# EAGLE design untitled (EAGLE 7.2.0)
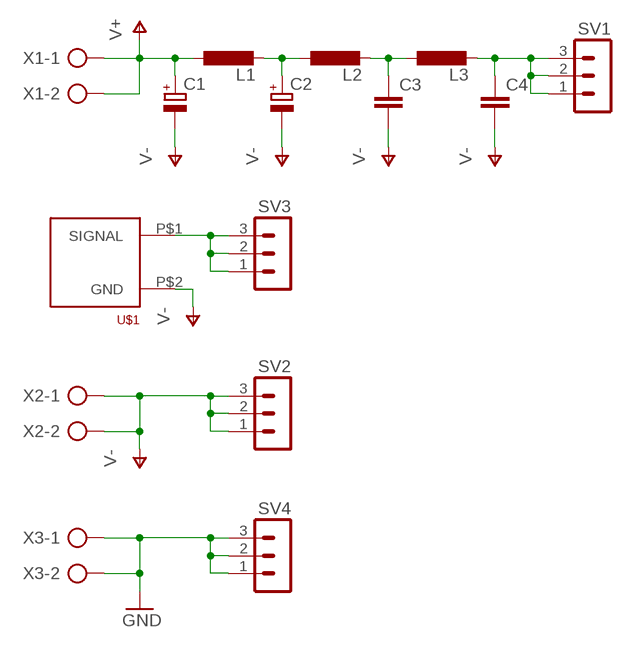
[diagram p0: schematic, sheet 1]

## Parts
C1  CPOL-EUSMCA  [SMC_A]
C2  CPOL-EUSMCA  [SMC_A]
C3  C-EUC1206  [C1206]
C4  C-EUC1206  [C1206]
L1  L-EU0204/7  [0204/7]
L2  L-EUL1812  [L1812]
L3  L-EUL1812  [L1812]
SV1  MA03-1  [MA03-1]
SV2  MA03-1  [MA03-1]
SV3  MA03-1  [MA03-1]
SV4  MA03-1  [MA03-1]
U$1  BNC_VERTICAL  [BNC_VERTICAL]
X1  AK500/2-H  [AK500/2-H]
X2  AK500/2-H  [AK500/2-H]
X3  AK500/2-H  [AK500/2-H]

## Nets
GND: SV4.1 SV4.2 SV4.3 X3.1 X3.2
N$10: C4.1 L3.2 SV1.1 SV1.2 SV1.3
N$11: C2.+ L1.2 L2.1
N$12: SV3.1 SV3.2 SV3.3 U$1.P$1(SIGNAL)
N$13: C3.1 L2.2 L3.1
V+: C1.+ L1.1 X1.1 X1.2
V-: C1.- C2.- C3.2 C4.2 SV2.1 SV2.2 SV2.3 U$1.P$2(GND) X2.1 X2.2

## Library data of the parts
C1 C2 = resistor:CPOL-EU: POLARIZED CAPACITOR, European symbol
C3 C4 = resistor:C-EU: CAPACITOR, European symbol
L1-L3 = resistor:L-EU: INDUCTOR, European symbol
SV1-SV4 = con-lstb:MA03-1: PIN HEADER; OC_FARNELL: unknown; OC_NEWARK: unknown
U$1 = connectors:BNC_VERTICAL: BNC plug, through-hole, vertical
X1-X3 = con-ptr500:AK500/2-H: CONNECTOR Aug. 2004 / PTR Meßtechnik: Die Bezeichnung der Serie AK505 wurde geändert. Es handelt sich hierbei um AK500 in horizontaler Ausführung.; OC_FARNELL: unknown; OC_NEWARK: unknown

## Board
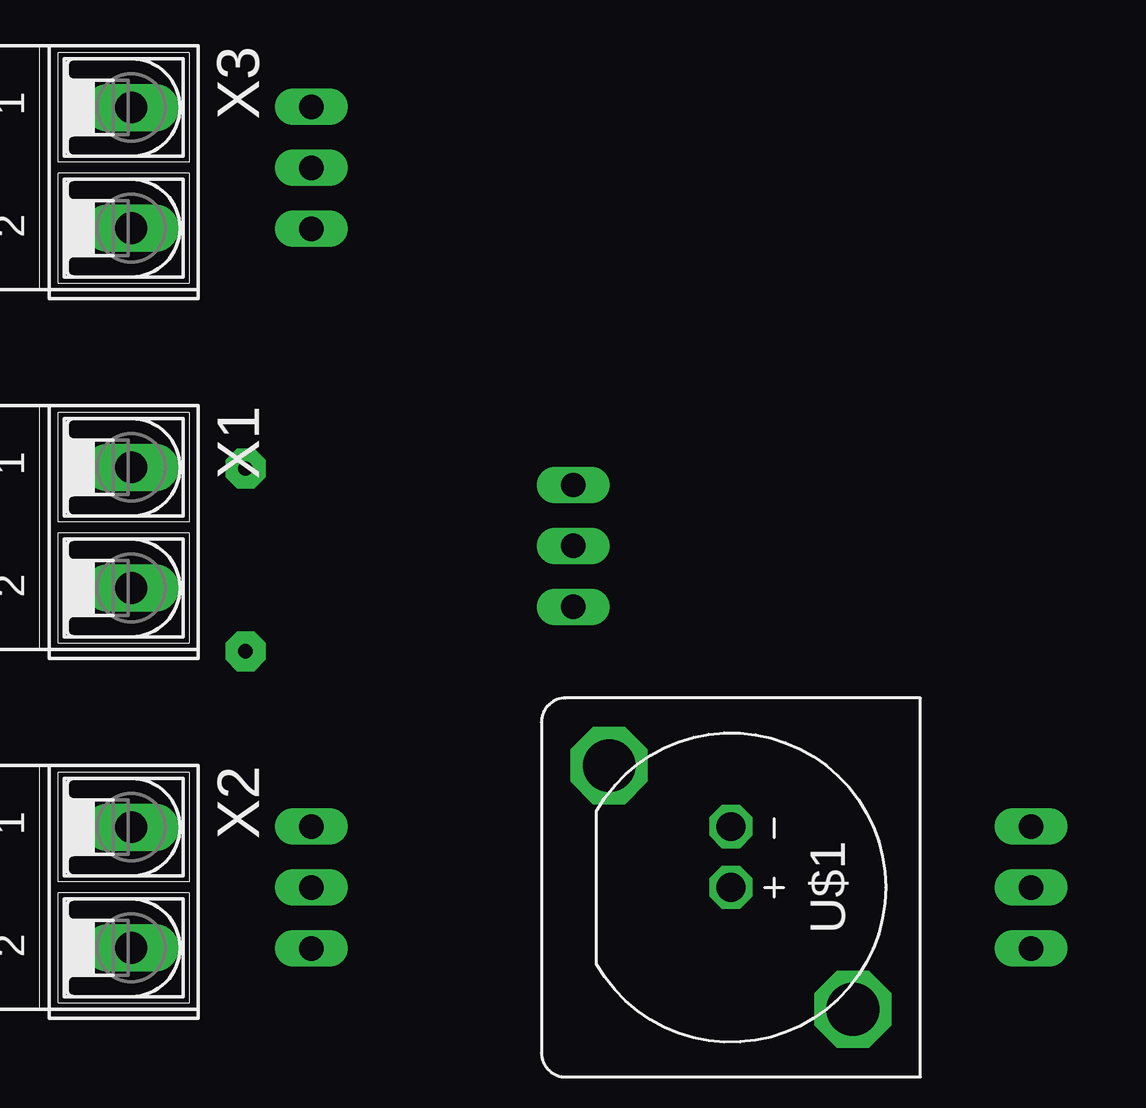
[diagram p1: board, top side]
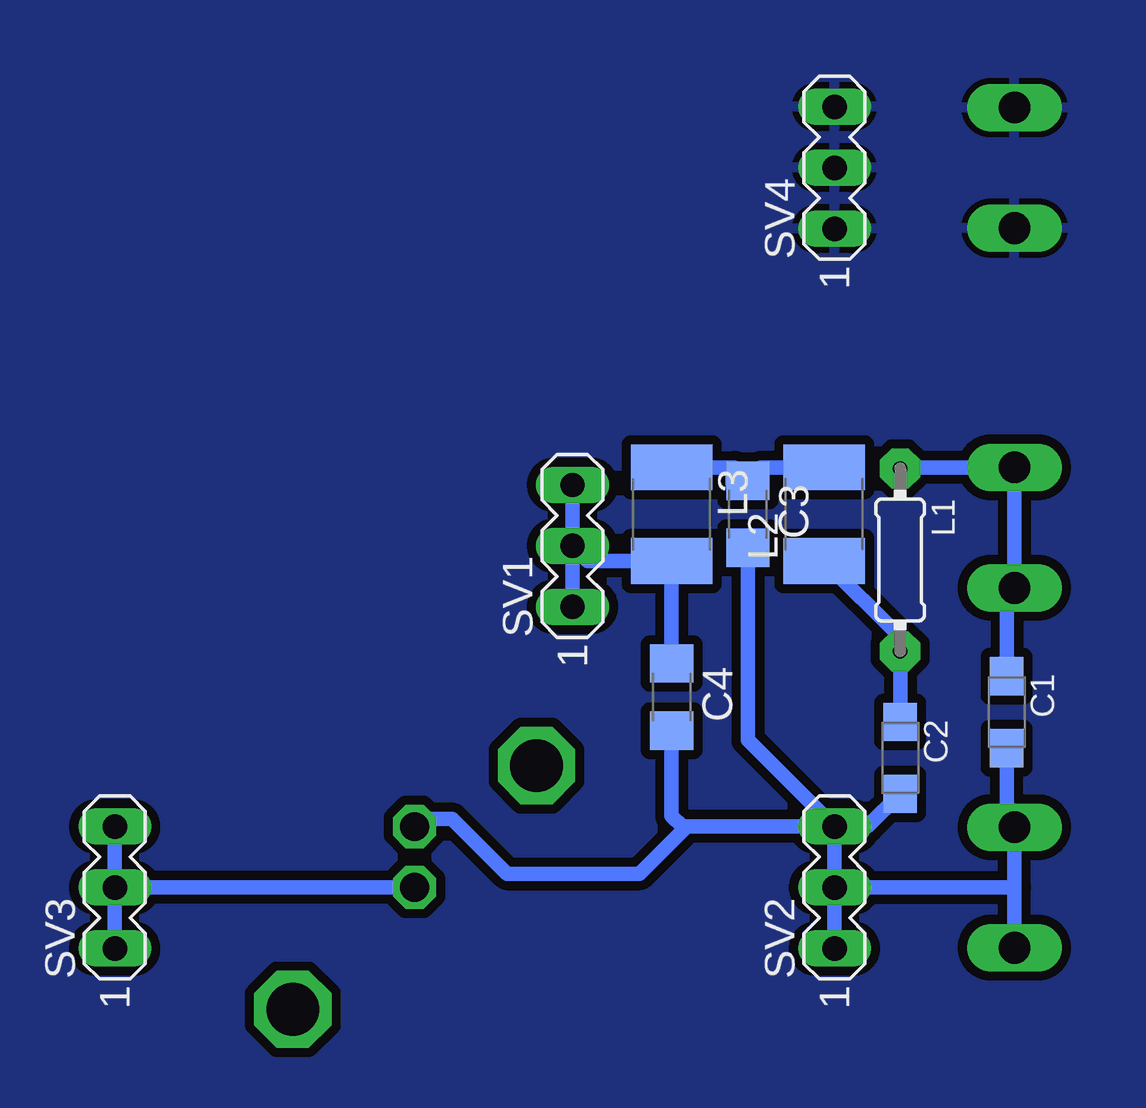
[diagram p2: board, bottom side, seen from below]

No outline drawn. Coordinates in mm, seen from the top.
Copper layers (1*16): Top 0.035mm / dielectric 1.5mm / Bottom 0.035mm
Design rules "default *": minimum track width 10mil, minimum drill 24mil, track to track 15mil, track to pad 15mil, pad to pad 8mil, via to via 8mil, smd to smd 8mil, copper to edge 40mil, drill to drill 8mil, minimum pad ring 10mil, minimum via ring 8mil, stop-mask expansion 4mil, vias tented up to drill 0mil, thermal gap 10mil

### Footprints (pad centres in the part's own frame; a part is rotated, then mirrored left to right if it is on the bottom)
SMC_A = smd 1.6 x 1.4: + -1.5,0; - 1.5,0
C1206 = smd 1.6 x 1.8: 1 -1.4,0; 2 1.4,0
0204/7 = drill 0.6 pad 1.676 octagon: 1 -3.81,0; 2 3.81,0
L1812 = smd 1.9 x 3.4: 1 -1.95,0; 2 1.95,0
MA03-1 = drill 1.016 long: 1 -2.54,0; 2 0,0; 3 2.54,0
BNC_VERTICAL = drill 1.2 octagon: P$1 0,0; P$2 2.54,0 | drill 2.2 octagon: P$3 5.08,5.08; P$4 -5.08,-5.08
AK500/2-H = drill 1.321 long: 1 -2.515,0; 2 2.515,0

### Placement (x,y rotation side)
C1  20.32,27.3 270 bottom
C2  24.77,25.4 270 bottom
C3  31.11,35.56 270 bottom
C4  34.29,27.94 270 bottom
L1  24.77,33.66 270 bottom
L2  27.94,35.56 90 bottom
L3  34.29,35.56 270 bottom
SV1  38.42,34.24 90 bottom
SV2  27.5,20 90 bottom
SV3  57.5,20 90 bottom
SV4  27.5,50 90 bottom
U$1  45,20 90 top
X1  20,35 270 top
X2  20,20 270 top
X3  20,50 270 top

### Tracks (layer width: path | path; a pad name or v marks a point on that pad's centre or on a via)
GND
  pour Bottom (rank 5): 0,0 0,100 100,100 100,0
  pour Bottom (rank 5): 120,0 120,100 220,100 220,0
N$1
  cutout Bottom: 50,120 50,340 150,340 150,120
N$2
  cutout Bottom: 150,120 150,340 250,340 250,120
N$3
  cutout Bottom: -50,120 -50,340 50,340 50,120
N$4
  cutout Bottom: -150,120 -150,340 -50,340 -50,120
N$5
  cutout Bottom: 250,120 250,340 260,340 260,120
N$6
  cutout Bottom: -150,120 -150,110 -50,110 -50,120
N$7
  cutout Bottom: -50,110 50,110 50,120 -50,120
N$8
  cutout Bottom: 50,110 150,110 150,120 50,120
N$9
  cutout Bottom: 150,110 250,110 250,120 150,120
N$10
  Bottom 0.61: L3.2 C4.1 | L3.2 34.29,33.02 | L3.2 37.79,33.61 SV1.2 | SV1.1 SV1.2 | SV1.2 SV1.3
N$11
  Bottom 0.61: C2.+ L1.2 24.77,30.43 L2.1
N$12
  Bottom 0.61: U$1.P$1 SV3.2 | SV3.2 SV3.1 | SV3.2 SV3.3
N$13
  Bottom 0.61: L2.2 30.57,37.51 C3.1 | C3.1 31.62,36.96 31.75,36.83 31.75,37.47 | L3.1 31.66,37.51 C3.1
V+
  Bottom 0.61: C1.+ 20.32,31.75 20,32.07 X1.2 X1.1 24.71,37.52 L1.1
V-
  Bottom 0.61: SV2.1 SV2.2 | X2.2 20,20 | 20,20 X2.1 20,22.54 20.32,22.86 C1.- | SV2.3 SV2.2 | SV2.2 20,20 | SV2.3 33.66,22.54 | 33.66,22.54 33.85,22.54 34.29,22.98 C4.2 | U$1.P$2 44.68,22.86 43.43,22.86 41.15,20.57 35.62,20.57 33.66,22.54 | SV2.3 26.12,22.54 C2.- | C3.2 31.11,26.16 SV2.3